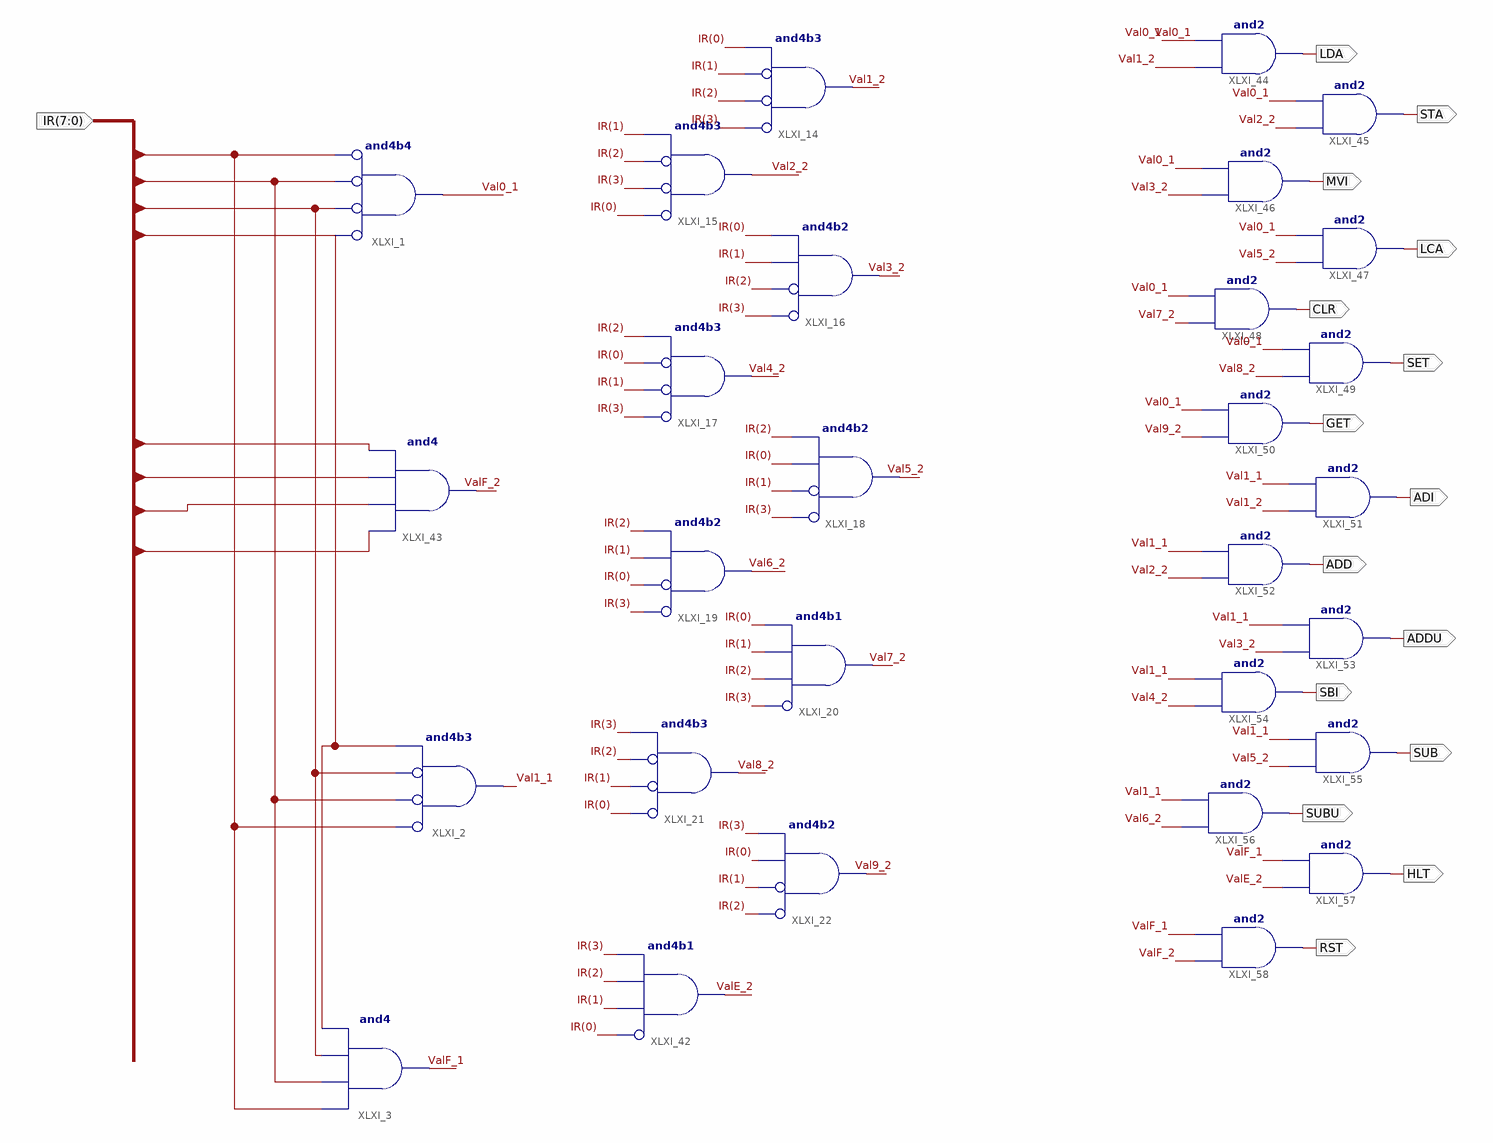
[diagram p0: schematic sheet 1]
// Xilinx ISE schematic ISA.sch (spartan3e) as structural Verilog: 29 symbols, 16 ports
module ISA (
  input  [7:0] IR,
  output LDA,
  output STA,
  output MVI,
  output LCA,
  output CLR,
  output SET,
  output GET,
  output ADI,
  output ADD,
  output ADDU,
  output SBI,
  output SUB,
  output SUBU,
  output HLT,
  output RST
);

  wire Val0_1, Val1_1, Val1_2, Val2_2, Val3_2, Val4_2, Val5_2, Val6_2, Val7_2, Val8_2, Val9_2, ValE_2,
       ValF_1, ValF_2;

  and XLXI_1 (Val0_1, ~IR[4], ~IR[5], ~IR[6], ~IR[7]);  // and4b4
  and XLXI_2 (Val1_1, ~IR[7], ~IR[6], ~IR[5], IR[4]);  // and4b3
  and XLXI_3 (ValF_1, IR[7], IR[6], IR[5], IR[4]);
  and XLXI_14 (Val1_2, ~IR[3], ~IR[2], ~IR[1], IR[0]);  // and4b3
  and XLXI_15 (Val2_2, ~IR[0], ~IR[3], ~IR[2], IR[1]);  // and4b3
  and XLXI_17 (Val4_2, ~IR[3], ~IR[1], ~IR[0], IR[2]);  // and4b3
  and XLXI_18 (Val5_2, ~IR[3], ~IR[1], IR[0], IR[2]);  // and4b2
  and XLXI_19 (Val6_2, ~IR[3], ~IR[0], IR[1], IR[2]);  // and4b2
  and XLXI_20 (Val7_2, ~IR[3], IR[2], IR[1], IR[0]);  // and4b1
  and XLXI_21 (Val8_2, ~IR[0], ~IR[1], ~IR[2], IR[3]);  // and4b3
  and XLXI_22 (Val9_2, ~IR[2], ~IR[1], IR[0], IR[3]);  // and4b2
  and XLXI_16 (Val3_2, ~IR[3], ~IR[2], IR[1], IR[0]);  // and4b2
  and XLXI_42 (ValE_2, ~IR[0], IR[1], IR[2], IR[3]);  // and4b1
  and XLXI_43 (ValF_2, IR[0], IR[1], IR[2], IR[3]);
  and XLXI_44 (LDA, Val1_2, Val0_1);
  and XLXI_45 (STA, Val2_2, Val0_1);
  and XLXI_46 (MVI, Val3_2, Val0_1);
  and XLXI_47 (LCA, Val5_2, Val0_1);
  and XLXI_48 (CLR, Val7_2, Val0_1);
  and XLXI_49 (SET, Val8_2, Val0_1);
  and XLXI_50 (GET, Val9_2, Val0_1);
  and XLXI_51 (ADI, Val1_2, Val1_1);
  and XLXI_52 (ADD, Val2_2, Val1_1);
  and XLXI_53 (ADDU, Val3_2, Val1_1);
  and XLXI_54 (SBI, Val4_2, Val1_1);
  and XLXI_55 (SUB, Val5_2, Val1_1);
  and XLXI_56 (SUBU, Val6_2, Val1_1);
  and XLXI_57 (HLT, ValE_2, ValF_1);
  and XLXI_58 (RST, ValF_2, ValF_1);
endmodule
